# EAGLE design controlPAP (EAGLE 7.2.0)
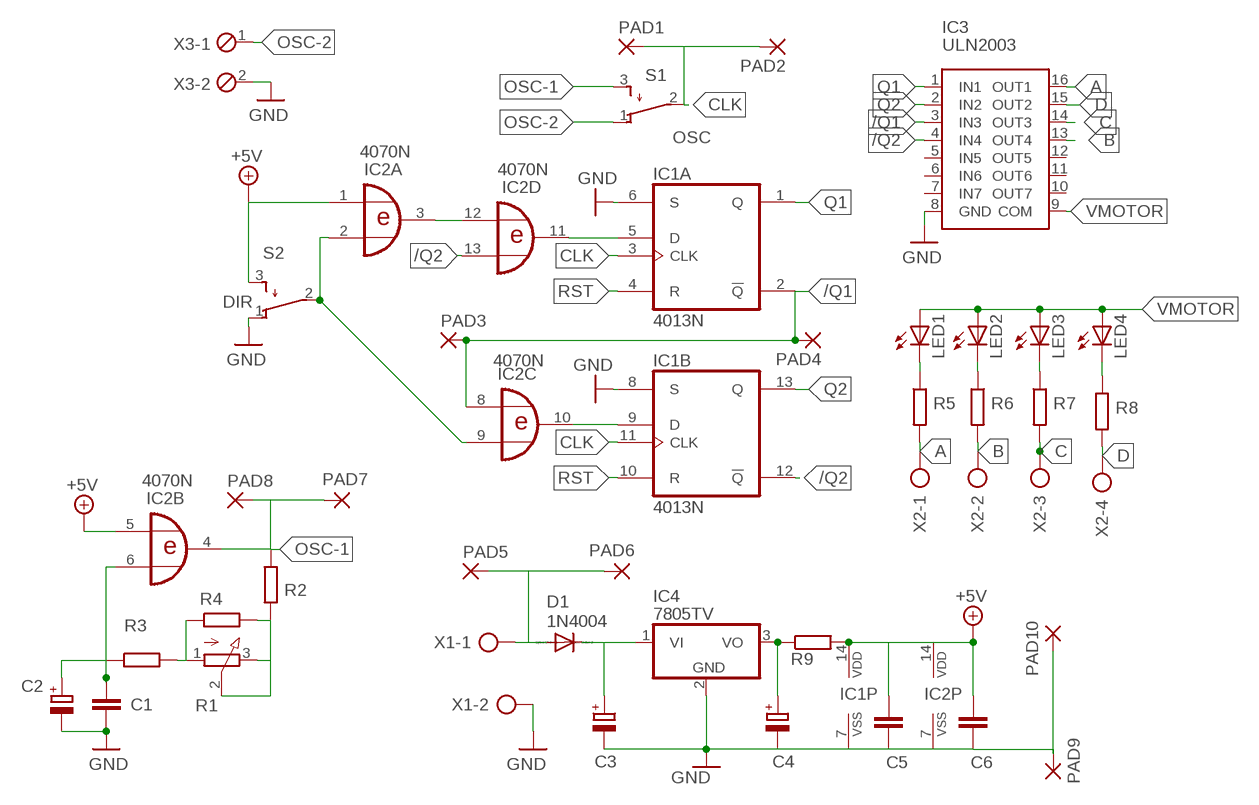
[diagram p0: schematic, sheet 1]

## Parts
C1  C-EU050-025X075  [C050-025X075]
C2  CPOL-EUE2.5-5  [E2,5-5]
C3  CPOL-EUE2.5-7  [E2,5-7]
C4  CPOL-EUE2.5-5  [E2,5-5]
C5  C-EU050-025X075  [C050-025X075]
C6  C-EU050-025X075  [C050-025X075]
D1  1N4004  [DO41-10]
IC1  4013N  [DIL14]
IC2  4070N  [DIL14]
IC3  ULN2003  [DIP16]
IC4  7805TV  [TO220V]
LED1  LED3MM  [LED_3MM]
LED2  LED3MM  [LED_3MM]
LED3  LED3MM  [LED_3MM]
LED4  LED3MM  [LED_3MM]
PAD1  1,6/0,9  [1,6/0,9]
PAD2  1,6/0,9  [1,6/0,9]
PAD3  1,6/0,9  [1,6/0,9]
PAD4  1,6/0,9  [1,6/0,9]
PAD5  1,6/0,9  [1,6/0,9]
PAD6  1,6/0,9  [1,6/0,9]
PAD7  1,6/0,9  [1,6/0,9]
PAD8  1,6/0,9  [1,6/0,9]
PAD9  1,6/0,9  [1,6/0,9]
PAD10  1,6/0,9  [1,6/0,9]
R1  3RP/1610N  [3RP/1610N]
R2  R-EU_0207/7  [0207/7]
R3  R-EU_0207/7  [0207/7]
R4  R-EU_0207/7  [0207/7]
R5  R-EU_0207/7  [0207/7]
R6  R-EU_0207/7  [0207/7]
R7  R-EU_0207/7  [0207/7]
R8  R-EU_0207/7  [0207/7]
R9  R-EU_0207/12  [0207/12]
S1  OSC  TL32PO  [TL3XPO]
S2  DIR  TL32PO  [TL3XPO]
X1  AK500/2  [AK500/2]
X2  AK500/4  [AK500/4]
X3  MPT2  [2POL254]

## Nets
+5V: C5.1 C6.1 IC1.14(P:VDD) IC2.14(P:VDD) R9.2
+12V: IC2.1(A:I0) IC2.5(B:I0) S2.3(S) ; supply symbol labelled +5V
/Q1: IC1.2(A:!Q) IC2.8(C:I0) IC3.3(IN3) PAD3.1(P) PAD4.1(P)
/Q2: IC1.12(B:!Q) IC2.13(D:I1) IC3.4(IN4)
A: IC3.16(OUT1) R5.2 X2.1
B: IC3.13(OUT4) R6.2 X2.2
C: IC3.14(OUT3) R7.2 X2.3
CLK: IC1.3(A:CLK) IC1.11(B:CLK) PAD1.1(P) PAD2.1(P) S1.2(P)
D: IC3.15(OUT2) R8.2 X2.4
GND: C1.2 C2.- C3.- C4.- C5.2 C6.2 IC1.6(A:S) IC1.7(P:VSS) IC1.8(B:S) IC2.7(P:VSS) IC3.8(GND) IC4.2(GND) PAD9.1(P) PAD10.1(P) S2.1(O) X1.2 X3.2
N$1: IC1.5(A:D) IC2.11(D:O)
N$2: IC2.2(A:I1) IC2.9(C:I1) S2.2(P)
N$3: IC2.3(A:O) IC2.12(D:I0)
N$4: D1.A PAD5.1(P) PAD6.1(P) X1.1
N$5: R1.1(A) R3.2 R4.1
N$6: LED1.K(C) R5.1
N$7: R1.2(S) R1.3(E) R2.2 R4.2
N$8: C3.+ D1.C IC4.1(VI)
N$9: LED2.K(C) R6.1
N$10: C1.1 C2.+ IC2.6(B:I1) R3.1
N$11: LED3.K(C) R7.1
N$12: LED4.K(C) R8.1
N$13: C4.+ IC4.3(VO) R9.1
N$15: IC1.9(B:D) IC2.10(C:O)
OSC-1: IC2.4(B:O) PAD7.1(P) PAD8.1(P) R2.1 S1.3(S)
OSC-2: S1.1(O) X3.1
Q1: IC1.1(A:Q) IC3.1(IN1)
Q2: IC1.13(B:Q) IC3.2(IN2)
RST: IC1.4(A:R) IC1.10(B:R)
VMOTOR: IC3.9(COM) LED1.A LED2.A LED3.A LED4.A
Unconnected: IC3.5(IN5) IC3.6(IN6) IC3.7(IN7) IC3.10(OUT7) IC3.11(OUT6) IC3.12(OUT5)

## Library data of the parts
C1 C5 C6 = rcl:C-EU: CAPACITOR, European symbol
C2-C4 = rcl:CPOL-EU: POLARIZED CAPACITOR, European symbol
D1 = diode:1N4004: DIODE general purpose rectifier, 1 A
IC1 = 40xx:4013: Dual D FLIP FLOP, set/reset
IC2 = 40xx:4070: Quad 2-input XOR
IC3 = treser_lib:ULN2003: Driver ULN2803
IC4 = linear:78*: Positive VOLTAGE REGULATOR Source: http://cache.national.com/ds/LM/LM78L05.pdf http://www.fairchildsemi.com/ds/LM/LM7805.pdf
LED1-LED4 = treser_lib:LED: LEDs
PAD1-PAD10 = wirepad:1,6/0,9: THROUGH-HOLE PAD
R1 = pot:3RP/1610N: 16mm Potentiometer one level Source: http://www.alphapotentiometers.net/html/16mm_pot_2.html
R2-R8 = rcl:R-EU_: RESISTOR, European symbol
R9 = resistor:R-EU_: RESISTOR, European symbol
S1 S2 = switch:TL32PO: TINY SWITCH ON - MOM Source: http://www2.produktinfo.conrad.com/datenblaetter/700000-724999/705152-da-01-de-Subminiaturschalter_TL_36YO.pdf
X1 = con-ptr500:AK500/2: CONNECTOR; OC_FARNELL: unknown; OC_NEWARK: unknown
X2 = con-ptr500:AK500/4: CONNECTOR; OC_FARNELL: unknown; OC_NEWARK: unknown
X3 = con-phoenix-254:MPT2: PHOENIX CONNECTOR; OC_FARNELL: unknown; OC_NEWARK: unknown

## Board
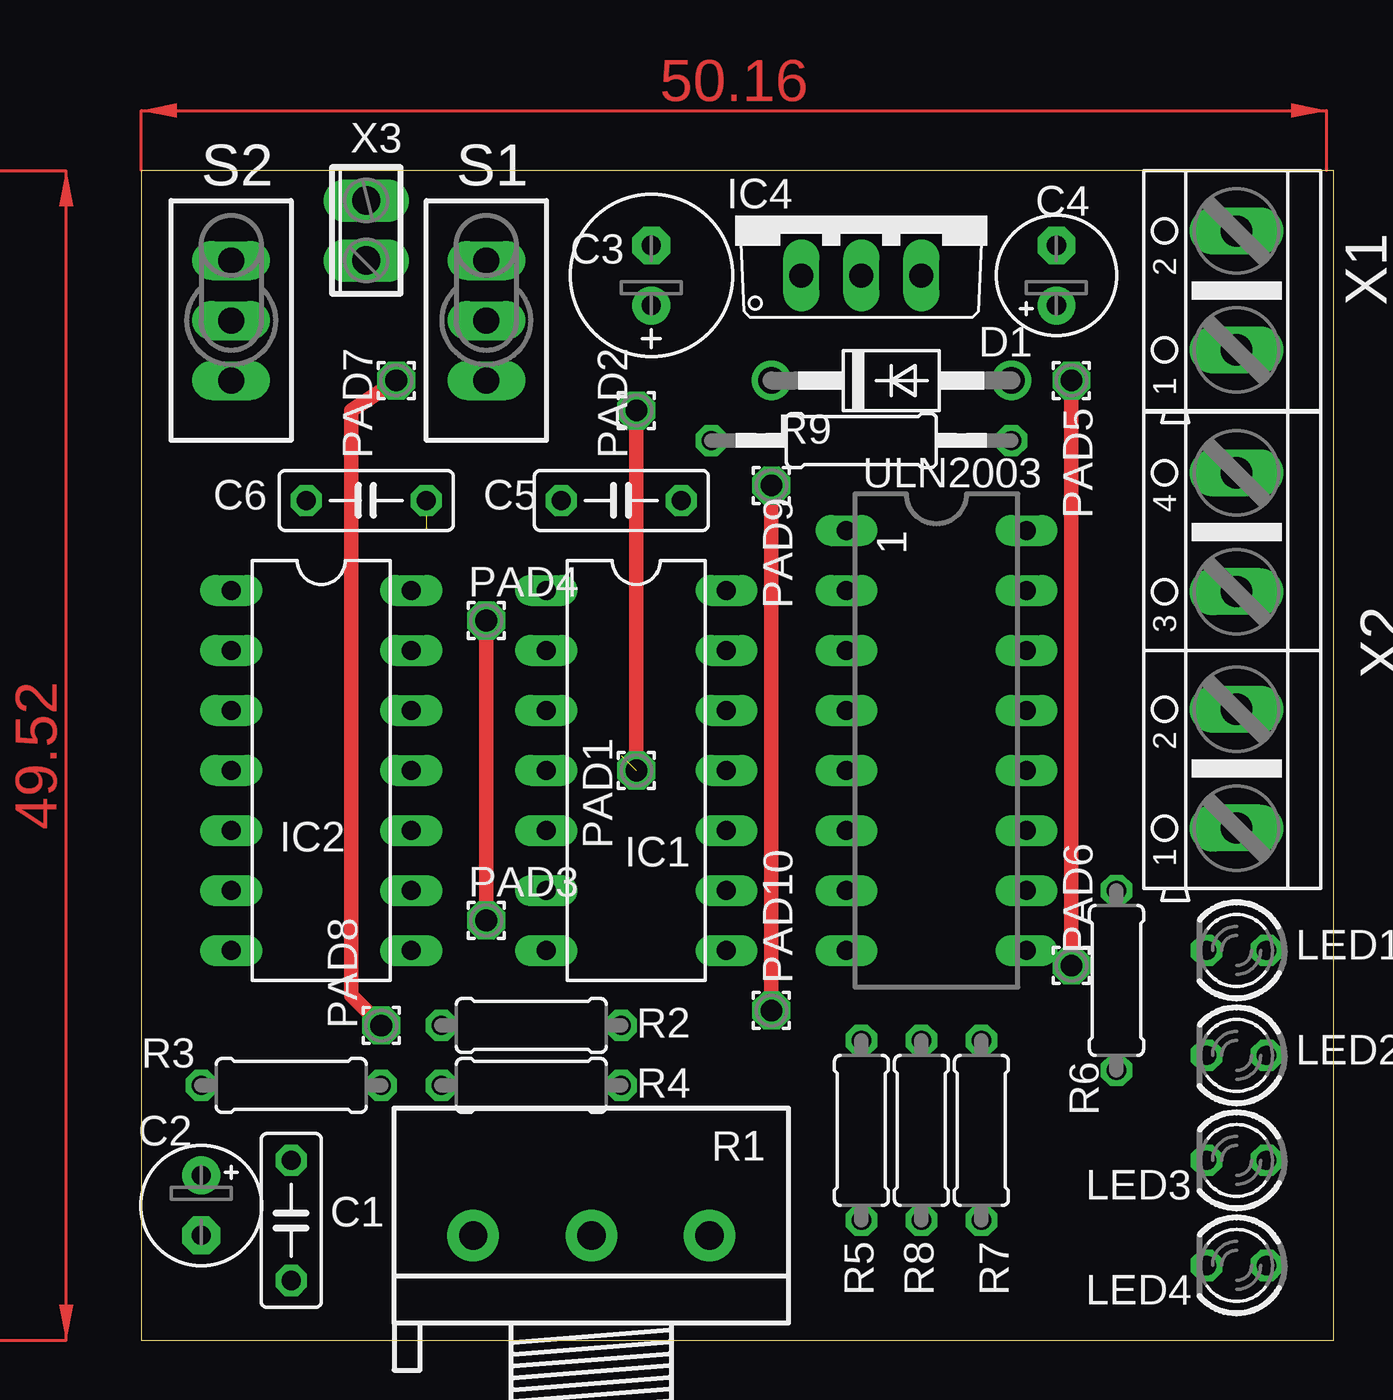
[diagram p1: board, top side]
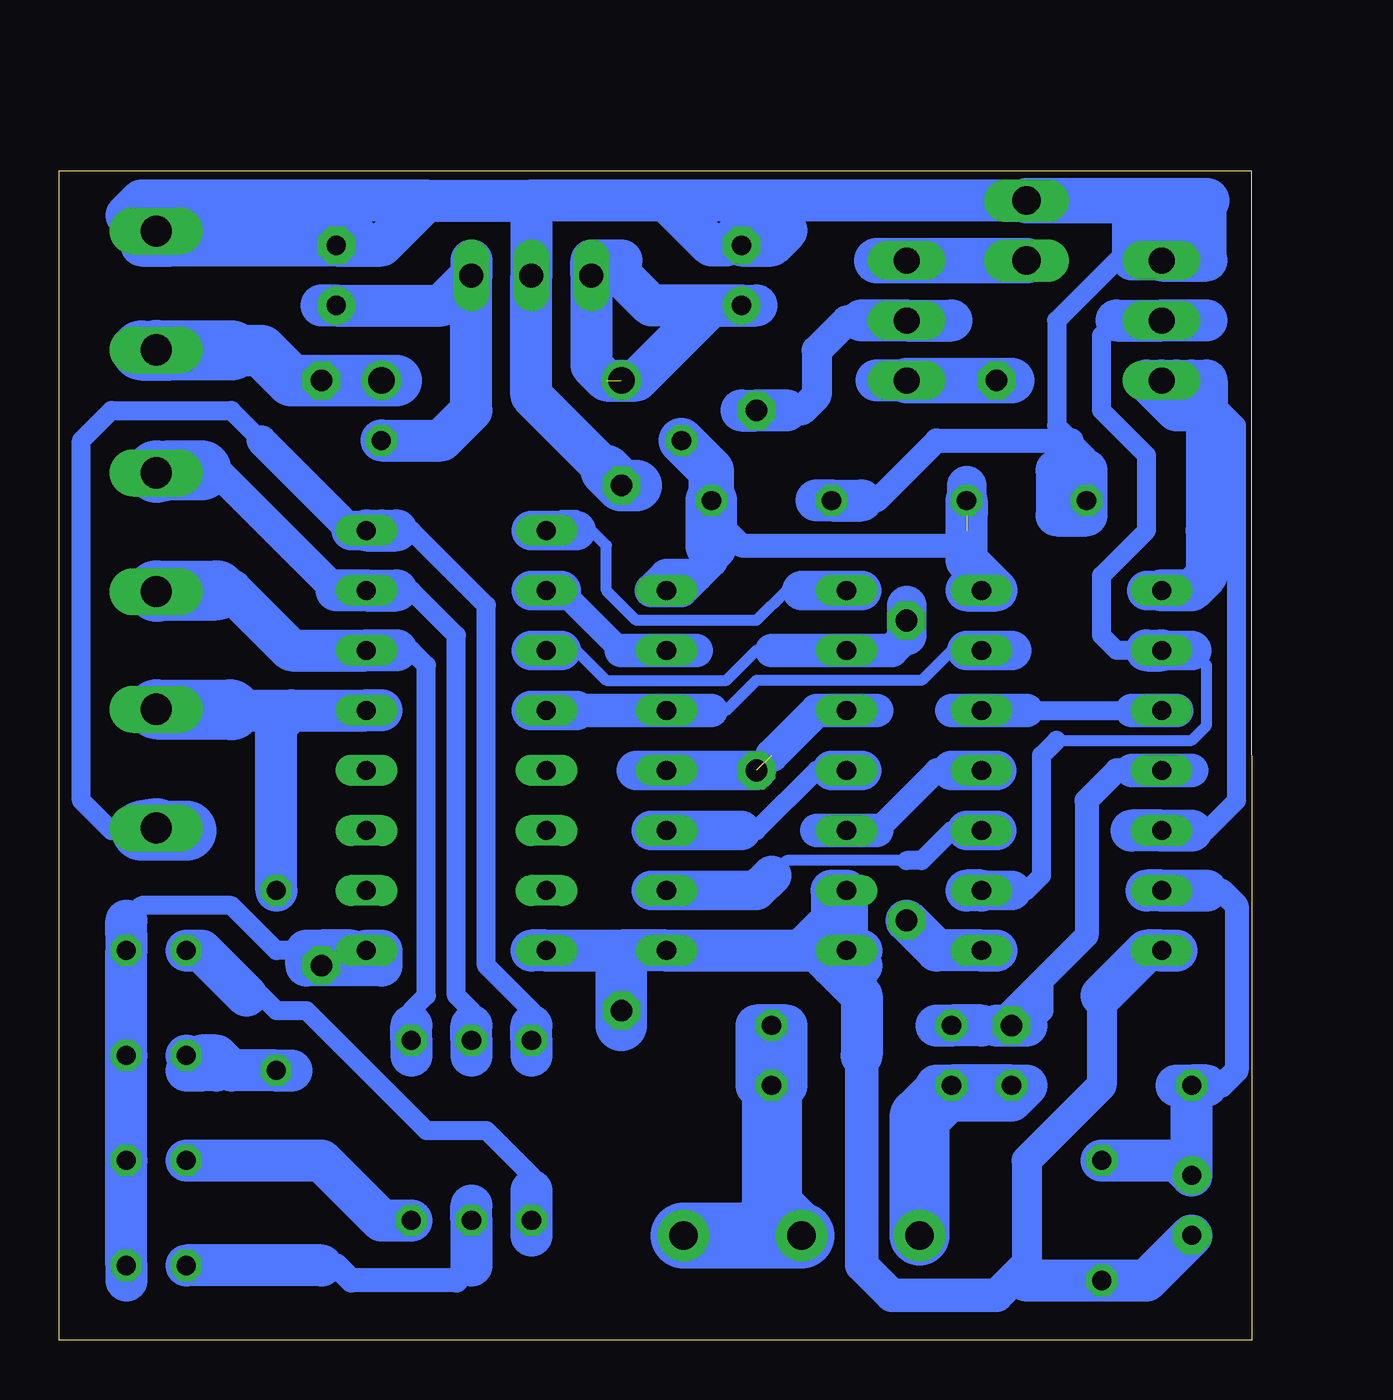
[diagram p2: board, bottom side, seen from below]

Size 50.47 x 49.53 mm. Coordinates in mm from the lower left corner, seen from the top.
Outline: 0,0 50.47,0 50.47,49.52 0.01,49.53 0,0
Copper layers (1*16): Top 0.035mm / dielectric 1.5mm / Bottom 0.035mm
Design rules "default": minimum track width 10mil, minimum drill 24mil, track to track 8mil, track to pad 8mil, pad to pad 8mil, via to via 8mil, smd to smd 8mil, copper to edge 40mil, drill to drill 8mil, minimum pad ring 10mil, minimum via ring 8mil, stop-mask expansion 4mil, vias tented up to drill 0mil, thermal gap 10mil

### Footprints (pad centres in the part's own frame; a part is rotated, then mirrored left to right if it is on the bottom)
C050-025X075 = drill 0.813 octagon: 1 -2.54,0; 2 2.54,0
E2,5-5 = drill 0.813 pad 1.6: + -1.27,0 | drill 0.813 pad 1.6 octagon: - 1.27,0
E2,5-7 = drill 0.813 pad 1.6: + -1.27,0 | drill 0.813 pad 1.6 octagon: - 1.27,0
DO41-10 = drill 1.118: A 5.08,0; C -5.08,0
DIL14 = drill 0.813 long: 1 -7.62,-3.81; 2 -5.08,-3.81; 3 -2.54,-3.81; 4 0,-3.81; 5 2.54,-3.81; 6 5.08,-3.81; 7 7.62,-3.81; 8 7.62,3.81; 9 5.08,3.81; 10 2.54,3.81; 11 0,3.81; 12 -2.54,3.81; 13 -5.08,3.81; 14 -7.62,3.81
DIP16 = drill 0.8 long: 1 -8.89,-3.81; 2 -6.35,-3.81; 3 -3.81,-3.81; 4 -1.27,-3.81; 5 1.27,-3.81; 6 3.81,-3.81; 7 6.35,-3.81; 8 8.89,-3.81; 9 8.89,3.81; 10 6.35,3.81; 11 3.81,3.81; 12 1.27,3.81; 13 -1.27,3.81; 14 -3.81,3.81; 15 -6.35,3.81; 16 -8.89,3.81
TO220V = drill 1.016 long: 1 -2.54,-2.54; 2 0,-2.54; 3 2.54,-2.54
LED_3MM = drill 0.813 octagon: A -1.27,0; K 1.27,0
1,6/0,9 = drill 0.914 pad 1.6 octagon: 1 0,0
3RP/1610N = drill 1.2 pad 2.184: 1 -5,0; 2 0,0; 3 5,0
0207/7 = drill 0.813 octagon: 1 -3.81,0; 2 3.81,0
0207/12 = drill 0.813 octagon: 1 -6.35,0; 2 6.35,0
TL3XPO = drill 1.1 pad 1.422 long: 1 -2.54,0; 2 0,0; 3 2.54,0
AK500/2 = drill 1.321 long: 1 -2.515,0; 2 2.515,0
AK500/4 = drill 1.321 long: 1 -7.518,0; 2 -2.489,0; 3 2.489,0; 4 7.518,0
2POL254 = drill 1.2 long: 1 -1.27,0; 2 1.27,0

### Placement (x,y rotation side)
C1  6.35,5.08 270 top
C2  2.54,5.71 270 top
C3  21.59,45.09 90 top
C4  38.73,45.09 90 top
C5  20.32,35.56 180 top
C6  9.52,35.56 180 top
D1  31.75,40.64 0 top
IC1  20.95,24.13 270 top
IC2  7.62,24.13 270 top
IC3  33.66,25.4 270 top
IC4  30.48,47.62 0 top
LED1  46.35,16.51 180 top
LED2  46.35,12.06 180 top
LED3  46.35,7.62 180 top
LED4  46.35,3.17 180 top
PAD1  20.95,24.13 0 top
PAD2  20.95,39.37 0 top
PAD3  14.61,17.78 0 top
PAD4  14.61,30.48 0 top
PAD5  39.37,40.64 0 top
PAD6  39.37,15.87 0 top
PAD7  10.79,40.64 0 top
PAD8  10.16,13.33 0 top
PAD9  26.67,36.2 0 top
PAD10  26.67,13.97 0 top
R1  19.05,4.45 0 top
R2  16.51,13.33 0 top
R3  6.35,10.79 0 top
R4  16.51,10.79 0 top
R5  30.48,8.89 90 top
R6  41.27,15.24 90 top
R7  35.56,8.89 90 top
R8  33.02,8.89 90 top
R9  30.48,38.1 180 top
S1  14.61,43.18 270 top
S2  3.81,43.18 270 top
X1  46.35,44.45 90 top
X2  46.35,29.21 90 top
X3  9.52,46.99 90 top

### Tracks (layer width: path | path; a pad name or v marks a point on that pad's centre or on a via)
+5V  (1 unrouted)
  Bottom 1.016: C5.1 22.86,34.93 21.59,33.66 12.7,33.66 12.06,34.29
  Bottom 1.422: 23.49,32.38 24.13,31.75 IC1.14 25.4,31.75 24.77,32.38 23.49,32.38 | 23.49,32.38 22.86,33.02 22.86,33.66
  Bottom 1.676: IC2.14 12.06,31.75 | 12.06,36.2 C6.1
  Bottom 1.778: 12.06,34.93 C6.1 12.06,33.02 10.79,31.75 12.06,31.75
  Bottom 1.93: R9.2 22.86,36.83 C5.1
  Bottom 2.184: 22.86,33.66 C5.1
+12V
  Bottom 0.813: 1.27,33.66 1.9,34.29 | 2.54,21.59 1.9,21.59 0.63,22.86 0.63,38.73 2.54,40.64
  Bottom 1.676: 4.45,31.75 IC2.1
  Bottom 1.778: S2.3 2.54,40.64 | 2.54,40.01 2.54,39.37 3.18,39.37 4.45,40.64 3.18,40.64 2.54,40.01 | 2.54,40.01 2.54,40.64 | 2.54,40.64 1.9,40.64 1.9,34.29 1.9,32.38 2.54,31.75 IC2.1 | 5.08,21.59 IC2.5 2.54,21.59
/Q1
  Top 0.61: PAD3.1 PAD4.1
  Bottom 0.457: 29.21,29.21 28.57,29.21 27.3,27.94 22.23,27.94 20.95,29.21 20.32,29.21
  Bottom 1.422: 20.32,29.21 IC1.2 15.24,29.21 14.61,29.84
  Bottom 1.676: 30.48,29.21 IC3.3 29.21,29.21 | 14.61,29.84 PAD4.1 14.61,31.12
  Bottom 1.778: 10.79,16.51 IC2.8 13.34,16.51 PAD3.1
/Q2
  Bottom 0.457: 12.06,29.21 12.7,29.21 13.97,27.94 20.95,27.94 22.23,26.67 22.86,26.67
  Bottom 1.422: 28.57,26.67 IC1.12 22.86,26.67
  Bottom 1.676: 30.48,26.67 IC3.4 28.57,26.67 | 10.16,29.21 IC2.13 12.06,29.21
A
  Bottom 0.813: 30.48,13.33 30.48,13.97 32.38,15.87 32.38,31.12 35.56,34.29 36.83,34.29 | 45.09,21.59 48.26,21.59 49.53,22.86 49.53,38.1 48.26,39.37 43.18,39.37 41.91,38.1
  Bottom 1.27: 41.91,38.1 38.1,34.29
  Bottom 1.676: 38.1,34.29 IC3.16
  Bottom 1.778: IC3.16 36.83,34.29 36.2,34.29 | 30.48,12.06 R5.2 30.48,13.33
  Bottom 2.54: X2.1 46.99,21.59 45.09,21.59
B
  Bottom 1.778: 36.83,26.67 IC3.13 40.64,26.67 | 43.18,26.67 40.64,26.67 | R6.2 41.27,26.04 40.64,26.67
  Bottom 2.54: X2.2 43.23,26.72 43.18,26.67
C
  Bottom 0.813: 35.56,13.33 35.56,13.97 34.92,14.6 34.92,28.58 35.56,29.21 36.83,29.21
  Bottom 1.778: 43.81,31.75 43.18,31.75 40.64,29.21 IC3.14 36.83,29.21 36.2,29.21 | 35.56,12.06 R7.2 35.56,13.33
  Bottom 2.54: X2.3 46.3,31.7 46.35,31.75 43.81,31.75
CLK  (1 unrouted)
  Top 0.61: PAD1.1 PAD2.1
  Bottom 1.27: 16.51,43.18 17.14,43.18 18.41,41.91 18.41,40.01 19.05,39.37 19.69,39.37
  Bottom 1.422: 15.88,26.67 IC1.3 18.41,26.67 20.32,24.77
  Bottom 1.676: 26.03,24.13 IC1.11 PAD1.1
  Bottom 1.778: 12.7,43.18 S1.2 16.51,43.18 | 21.59,39.37 PAD2.1 19.69,39.37
D
  Bottom 0.813: 33.02,13.33 33.02,13.97 33.66,14.6 33.66,29.84 35.56,31.75 36.2,31.75
  Bottom 1.27: 38.73,31.75 43.81,36.83 44.45,36.83
  Bottom 1.778: 36.2,31.75 IC3.15 38.73,31.75 | 33.02,12.06 R8.2 33.02,13.33
  Bottom 2.54: 44.45,36.83 45.82,36.83 | 46.35,36.83 45.82,36.83 | 45.82,36.83 X2.4
GND  (via drill 0.6)
  Top 0.61: PAD10.1 PAD9.1
  Bottom 0.813: 4.45,46.99 8.25,43.18 8.25,38.73 6.98,37.47 6.98,36.83
  Bottom 1.016: 6.98,34.93 6.98,36.83 7.62,37.47 7.62,38.1 13.34,38.1 15.88,35.56 16.51,35.56
  Bottom 1.27: 6.35,14.6 6.35,10.79 9.52,7.62 9.52,3.17 9.52,2.54
  Bottom 1.422: 16.51,12.06 16.51,3.17 15.24,1.9 10.79,1.9 9.52,3.17
  Bottom 1.676: 1.9,45.72 1.9,48.26 5.08,48.26 | 7.62,48.26 5.08,48.26 | 5.08,48.26 5.08,45.72 2.54,45.72 2.54,46.99 4.45,46.99
  Bottom 1.778: 3.18,45.72 S2.1 1.9,45.72 | 3.18,16.51 IC2.7 4.45,16.51 6.35,14.6 | IC1.6 17.14,17.15 17.78,16.51 17.78,17.78 | IC1.6 17.78,19.05 17.78,17.78 | IC1.6 IC1.7 | 19.05,16.51 IC1.8 26.67,16.51 | 19.05,16.51 18.41,16.51 | 37.46,46.36 C4.- 45.72,46.36 | 46.99,46.36 45.72,46.36 | 45.72,46.36 X1.2 | 26.67,16.51 IC3.8 30.48,16.51 | 18.41,35.56 C5.2 16.51,35.56 | X3.2 24.77,48.26 | 24.77,48.26 30.48,48.26 | 34.92,48.26 46.99,48.26 47.62,47.62 38.73,47.62 37.46,46.36 | 37.46,46.36 36.83,46.36 34.92,48.26 | 34.92,48.26 30.48,48.26 | 30.48,48.26 IC4.2 30.48,40.01 27.3,36.83 | C3.- 20.32,46.36 19.69,46.99 21.59,46.99 22.23,46.36 22.86,46.36 24.77,48.26 | C2.- 4.45,2.54 C1.2 9.52,2.54 | IC1.7 16.51,16.51 | 18.41,16.51 IC1.7 | IC1.7 16.51,15.87 17.78,15.87 | 17.78,15.87 18.41,16.51 | 17.78,15.87 16.51,14.6 16.51,12.06 | 26.67,15.87 26.67,16.51 | 17.78,17.78 19.05,16.51 | 6.98,34.93 C6.2 6.98,36.83 8.25,36.83 8.25,34.93 6.98,34.93
  Bottom 1.93: X3.2 1.9,48.26
  Bottom 2.184: 26.67,13.33 PAD10.1 26.67,15.87 | 26.03,36.2 PAD9.1 27.3,36.83
  other vias: 26.67,13.97
N$1
  Bottom 1.016: 15.88,21.59 13.34,24.13 12.7,24.13
  Bottom 1.422: 18.41,21.59 IC1.5 15.88,21.59
  Bottom 1.676: 12.7,24.13 IC2.11 10.79,24.13
N$2
  Bottom 0.457: 8.25,25.4 2.54,25.4 1.9,26.04 1.9,28.58 2.54,29.21
  Bottom 0.813: 3.18,29.21 5.71,29.21 6.35,29.84 6.35,32.38 4.45,34.29 4.45,37.47 6.35,39.37 6.35,42.55 5.71,43.18 | 10.16,19.05 9.52,19.05 8.89,19.69 8.89,24.77 8.25,25.4
  Bottom 1.676: IC2.2 3.18,29.21 2.54,29.21 | IC2.9 10.16,19.05
  Bottom 1.778: 4.45,29.21 IC2.2 | IC2.9 12.06,19.05 | 5.71,43.18 S2.2 1.9,43.18
N$3
  Bottom 0.813: 9.52,26.67 5.08,26.67
  Bottom 1.422: 12.7,26.67 IC2.12 9.52,26.67 | 5.08,26.67 IC2.3 3.18,26.67
N$4
  Top 0.61: PAD5.1 PAD6.1
  Bottom 2.184: 36.2,40.64 D1.A PAD5.1 40.64,40.64 41.91,41.91 43.18,41.91
  Bottom 2.54: 43.18,41.91 45.74,41.91 | 46.99,41.91 45.74,41.91 | 45.74,41.91 X1.1
N$5
  Bottom 1.778: 13.34,10.79 R4.1 R3.2 9.52,10.79 10.16,10.16 13.34,10.16
  Bottom 2.54: R1.1 14.05,9.44 13.34,10.16
N$6
  Bottom 0.813: 42.55,14.6 41.91,14.6 41.27,13.97 40.01,13.97 34.92,8.89 32.38,8.89 30.48,6.99 30.48,6.35
  Bottom 1.778: 30.48,4.45 R5.1 30.48,6.35 | LED1.K 44.45,16.51 42.55,14.6
N$7
  Bottom 1.778: R4.2 19.69,10.79 19.69,13.33 R2.2 | R2.2 20.95,13.33 20.95,10.79 R4.2 | R2.2 R4.2
  Bottom 2.54: R4.2 20.32,5.71 R1.2
  Bottom 2.794: R1.3 R1.2
N$8  (1 unrouted)
  Bottom 1.778: C3.+ 22.86,43.82 26.03,40.64 27.3,40.64 27.94,41.27 IC4.1 27.94,45.72 26.67,45.72 26.67,45.09 25.4,43.82 C3.+ | C3.+ 20.95,43.82
N$9
  Bottom 1.778: 40.64,11.43 R6.1 43.18,11.43 43.81,12.06 44.45,12.06 45.09,11.43 44.45,11.43 | 43.81,11.43 44.45,11.43 | 44.45,11.43 LED2.K
N$10
  Bottom 1.016: 1.9,19.05 1.27,19.05 0.63,18.41 0.63,11.43 1.27,10.79 1.9,10.79
  Bottom 1.778: 4.45,19.05 IC2.6 1.9,19.05 | 1.9,10.79 R3.1 | 3.18,10.79 R3.1 | C1.1 3.18,7.62 C2.+ R3.1
N$11
  Bottom 1.778: LED3.K 39.37,7.62 36.83,5.08 R7.1
N$12
  Bottom 1.016: 33.02,3.17 33.66,2.54 38.1,2.54 38.73,3.17 39.37,3.17
  Bottom 1.778: 33.02,5.71 R8.1 33.02,3.17 | 39.37,3.17 LED4.K
N$13
  Bottom 1.778: IC4.3 33.02,39.37 34.29,38.1 R9.1 | 33.02,45.72 IC4.3 | 39.37,43.82 C4.+ 34.29,43.82 IC4.3
N$15
  Bottom 0.457: 14.61,20.32 19.69,20.32 20.32,19.69
  Bottom 0.813: 12.06,21.59 12.7,21.59 13.97,20.32 14.61,20.32
  Bottom 1.676: 10.79,21.59 IC2.10 12.06,21.59 | 20.32,19.69 20.95,19.05 IC1.9 25.4,19.05
OSC-1
  Top 0.61: PAD7.1 8.89,39.37 8.89,14.6 PAD8.1
  Bottom 1.016: 5.08,24.13 5.71,24.13 6.98,22.86 6.98,17.15 8.89,15.24 | 8.89,15.24 10.79,13.33 11.43,13.33 | 9.52,13.33 8.89,13.97 8.89,15.24 | PAD8.1 R2.1
  Bottom 1.422: 2.54,24.13 IC2.4 5.08,24.13
  Bottom 1.778: 11.43,13.33 R2.1 13.34,13.33 | S1.3 15.88,40.64 | 10.79,13.33 PAD8.1 9.52,13.33
  Bottom 1.93: 10.16,40.64 PAD7.1 S1.3
OSC-2
  Bottom 1.93: X3.1 S1.1 15.88,45.72
Q1
  Bottom 0.457: 19.05,31.75 19.69,31.75 20.95,30.48 26.03,30.48 27.3,31.75 27.3,33.66 28.57,34.93 29.21,34.93 IC3.1
  Bottom 1.676: 30.48,34.29 IC3.1 28.57,34.29 | 16.51,31.75 IC1.1 19.05,31.75
Q2
  Bottom 1.016: 29.21,31.75 26.67,29.21
  Bottom 1.422: 26.67,29.21 IC1.13 23.49,29.21
  Bottom 1.676: 30.48,31.75 IC3.2 29.21,31.75
RST
  Bottom 0.813: 21.59,21.59 20.95,21.59 18.41,24.13 17.78,24.13
  Bottom 1.676: 25.4,21.59 IC1.10 21.59,21.59 | 16.51,24.13 IC1.4 17.78,24.13
VMOTOR
  Bottom 0.813: 39.37,16.51 41.27,16.51 43.18,18.41 46.99,18.41 47.62,17.78
  Bottom 1.778: 47.62,2.54 LED4.A LED3.A LED2.A LED1.A 47.62,17.15 47.62,17.78 | IC3.9 36.83,16.51 36.83,15.87 40.01,15.87 40.01,16.51 39.37,16.51 38.1,16.51
(copper drawn outside any net)
  shapes: Top area x2